# EAGLE schematic afron_atmega328 (EAGLE 6.1)
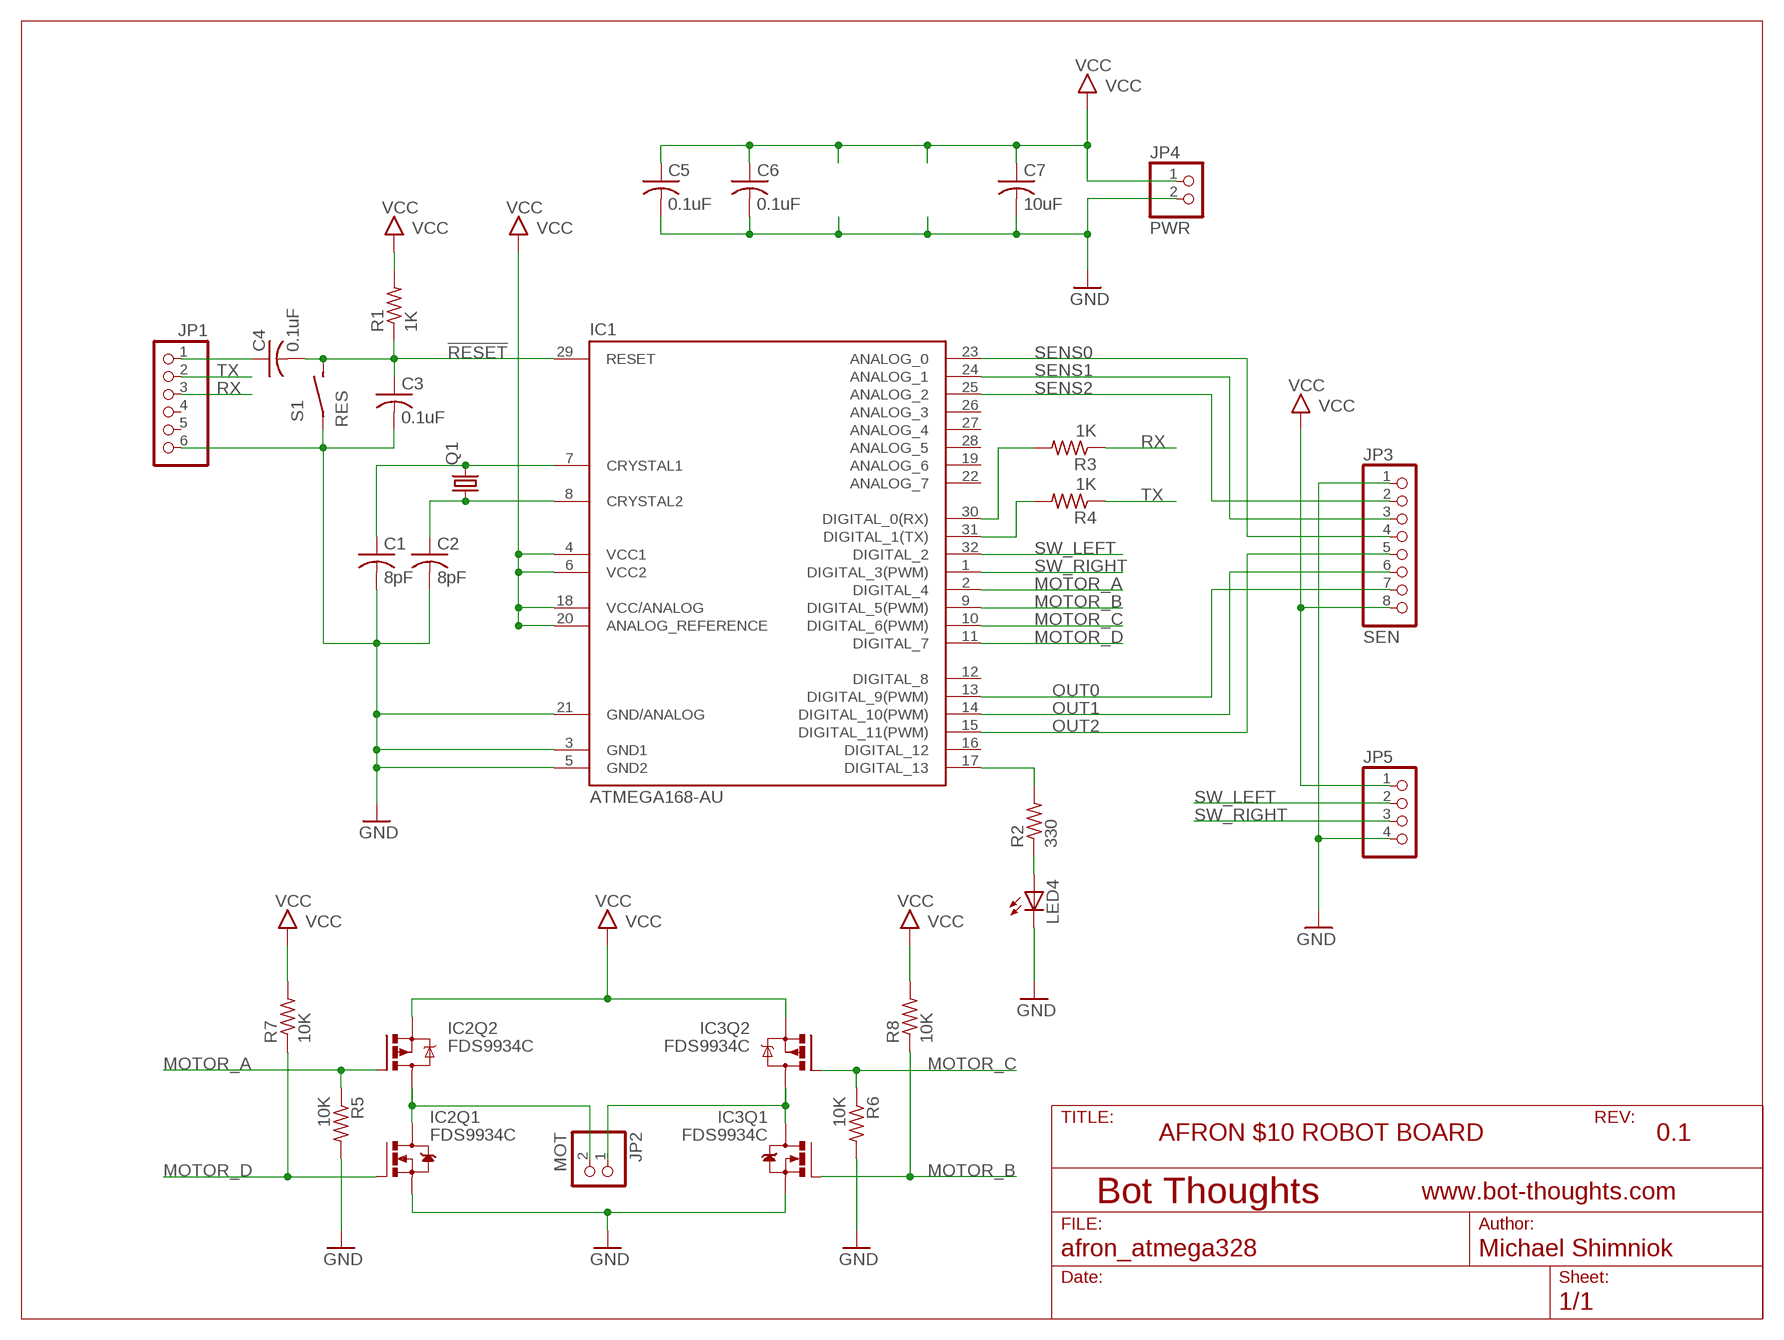
[diagram p0: schematic, sheet 1]

## Parts
C1  8pF  C-USC0603  [C0603]
C2  8pF  C-USC0603  [C0603]
C3  0.1uF  C-USC0603  [C0603]
C4  0.1uF  C-USC0603  [C0603]
C5  0.1uF  C-USC0603  [C0603]
C6  0.1uF  C-USC0603  [C0603]
C7  10uF  C-USC0805  [C0805]
IC1  ATMEGA168-AU  [TQFP32-08]
IC2  FDS9934C  [SOIC8]
IC3  FDS9934C  [SOIC8]
JP1  PINHD-1X06_2.54-S  [1X06-S]
JP2  MOT  PINHD-1X02_2.54-S  [1X02-S]
JP3  SEN  PINHD-1X08_2.54-S  [1X08-S]
JP4  PWR  PINHD-1X02_2.54-S  [1X02-S]
JP5  PINHD-1X04_2.54-S  [1X04-S]
LED4  LEDSML0805  [SML0805]
Q1  CRYSTALNDK5X3  [NDK_2PAD_5X3]
R1  1K  R-US_R0603  [R0603]
R2  330  R-US_R0603  [R0603]
R3  1K  R-US_R0603  [R0603]
R4  1K  R-US_R0603  [R0603]
R5  10K  R-US_R0603  [R0603]
R6  10K  R-US_R0603  [R0603]
R7  10K  R-US_R0603  [R0603]
R8  10K  R-US_R0603  [R0603]
S1  RES  SPST_TAC_RECT1  [6MMTACTILE_RECT]

## Nets
!RESET: C3.1 C4.2 IC1.29(RESET) R1.1 S1.P$2(S)
GND: C1.2 C2.2 C5.2 C6.2 C7.2 IC1.3(GND1) IC1.5(GND2) IC1.21(GND/ANALOG) IC2.1(Q1:S) IC3.1(Q1:S) JP1.6 JP3.1 JP4.2 JP5.4 LED4.C R5.2 R6.2 S1.P$1(P)
MA: IC2.5(Q2:D) IC2.6(Q2:D) IC2.7(Q1:D) IC2.8(Q1:D) JP2.2
MB: IC3.5(Q2:D) IC3.6(Q2:D) IC3.7(Q1:D) IC3.8(Q1:D) JP2.1
MOTOR_A: IC1.2(DIGITAL_4) IC2.4(Q2:G) R5.1
MOTOR_B: IC1.9(DIGITAL_5(PWM)) IC3.2(Q1:G) R8.1
MOTOR_C: IC1.10(DIGITAL_6(PWM)) IC3.4(Q2:G) R6.1
MOTOR_D: IC1.11(DIGITAL_7) IC2.2(Q1:G) R7.1
N$2: C1.1 IC1.7(CRYSTAL1) Q1.P$2
N$3: C2.1 IC1.8(CRYSTAL2) Q1.P$1
N$4: C4.1 JP1.1
N$5: IC1.17(DIGITAL_13) R2.2
N$6: LED4.A R2.1
N$8: IC1.31(DIGITAL_1(TX)) R4.2
N$9: IC1.30(DIGITAL_0(RX)) R3.2
N$21: C3.2
OUT0: IC1.13(DIGITAL_9(PWM)) JP3.7
OUT1: IC1.14(DIGITAL_10(PWM)) JP3.6
OUT2: IC1.15(DIGITAL_11(PWM)) JP3.5
RX: JP1.3 R3.1
SENS0: IC1.23(ANALOG_0) JP3.4
SENS1: IC1.24(ANALOG_1) JP3.3
SENS2: IC1.25(ANALOG_2) JP3.2
SW_LEFT: IC1.32(DIGITAL_2) JP5.2
SW_RIGHT: IC1.1(DIGITAL_3(PWM)) JP5.3
TX: JP1.2 R4.1
VCC: C5.1 C6.1 C7.1 IC1.4(VCC1) IC1.6(VCC2) IC1.18(VCC/ANALOG) IC1.20(ANALOG_REFERENCE) IC2.3(Q2:S) IC3.3(Q2:S) JP3.8 JP4.1 JP5.1 R1.2 R7.2 R8.2
Unconnected: IC1.12(DIGITAL_8) IC1.16(DIGITAL_12) IC1.19(ANALOG_6) IC1.22(ANALOG_7) IC1.26(ANALOG_3) IC1.27(ANALOG_4) IC1.28(ANALOG_5) JP1.4 JP1.5

## Notes on the sheet
- AFRON $10 ROBOT BOARD | 0.1

## Library data of the parts
C1-C7 = rcl:C-US: CAPACITOR, American symbol
IC1 = Arduino-AVR:ATMEGA168
IC2 IC3 = mes_motor_driver:FDS9934C: Complementary MOSFET These dual N- and P-Channel enhancement mode power field effect transistors are produced using Fairchild Semiconductor’s advanced PowerTrench process that has been especially tailored to minimize on-state ressitance and yet maintain superior switching performance. These devices are well suited for low voltage and battery powered applications where low in-line power loss and fast switching are required. http://www.fairchildsemi.com/ds/FD/FDS9934C.pdf
JP1 = pinhead-2:PINHD-1X06: PIN HEADER
JP2 JP4 = pinhead-2:PINHD-1X02: PIN HEADER
JP3 = pinhead-2:PINHD-1X08: PIN HEADER
JP5 = pinhead-2:PINHD-1X04: PIN HEADER
LED4 = led:LED: LED OSRAM: - CHIPLED LG R971, LG N971, LY N971, LG Q971, LY Q971, LO R971, LY R971 LH N974, LH R974 LS Q976, LO Q976, LY Q976 LO Q996 - Hyper CHIPLED LW Q18S LB Q993, LB Q99A, LB R99A - SideLED LS A670, LO A670, LY A670, LG A670, LP A670 LB A673, LV A673, LT A673, LW A673 LH A674 LY A675 LS A676, LA A676, LO A676, LY A676, LW A676 LS A679, LY A679, LG A679 - Hyper Micro SIDELED® LS Y876, LA Y876, LO Y876, LY Y876 LT Y87S - SmartLED LW L88C, LW L88S LB L89C, LB L89S, LG L890 LS L89K, LO L89K, LY L89K LS L896, LA L896, LO L896, LY L896 - TOPLED LS T670, LO T670, LY T670, LG T670, LP T670 LSG T670, LSP T670, LSY T670, LOP T670, LYG T670 LG T671, LOG T671, LSG T671 LB T673, LV T673, LT T673, LW T673 LH T674 LS T676, LA T676, LO T676, LY T676, LB T676, LH T676, LSB T676, LW T676 LB T67C, LV T67C, LT T67C, LS T67K, LO T67K, LY T67K, LW E67C LS E67B, LA E67B, LO E67B, LY E67B, LB E67C, LV E67C, LT E67C LW T67C LS T679, LY T679, LG T679 LS T770, LO T770, LY T770, LG T770, LP T770 LB T773, LV T773, LT T773, LW T773 LH T774 LS E675, LA E675, LY E675, LS T675 LS T776, LA T776, LO T776, LY T776, LB T776 LHGB T686 LT T68C, LB T68C - Hyper Mini TOPLED® LB M676 - Mini TOPLED Santana® LG M470 LS M47K, LO M47K, LY M47K Source: http://www.osram.convergy.de LUXEON: - LUMILED® LXK2-PW12-R00, LXK2-PW12-S00, LXK2-PW14-U00, LXK2-PW14-V00 LXK2-PM12-R00, LXK2-PM12-S00, LXK2-PM14-U00 LXK2-PE12-Q00, LXK2-PE12-R00, LXK2-PE12-S00, LXK2-PE14-T00, LXK2-PE14-U00 LXK2-PB12-K00, LXK2-PB12-L00, LXK2-PB12-M00, LXK2-PB14-N00, LXK2-PB14-P00, LXK2-PB14-Q00 LXK2-PR12-L00, LXK2-PR12-M00, LXK2-PR14-Q00, LXK2-PR14-R00 LXK2-PD12-Q00, LXK2-PD12-R00, LXK2-PD12-S00 LXK2-PH12-R00, LXK2-PH12-S00 LXK2-PL12-P00, LXK2-PL12-Q00, LXK2-PL12-R00 Source: www.luxeon.com KINGBRIGHT: KA-3528ASYC Source: www.kingbright.com
Q1 = mes_crystal:CRYSTAL: CRYSTAL
R1-R8 = resistor:R-US_: RESISTOR, American symbol
S1 = mes_electromech:SPST: SPST SWITCH